# EAGLE design controller_board_LCD (EAGLE 9.0.0)
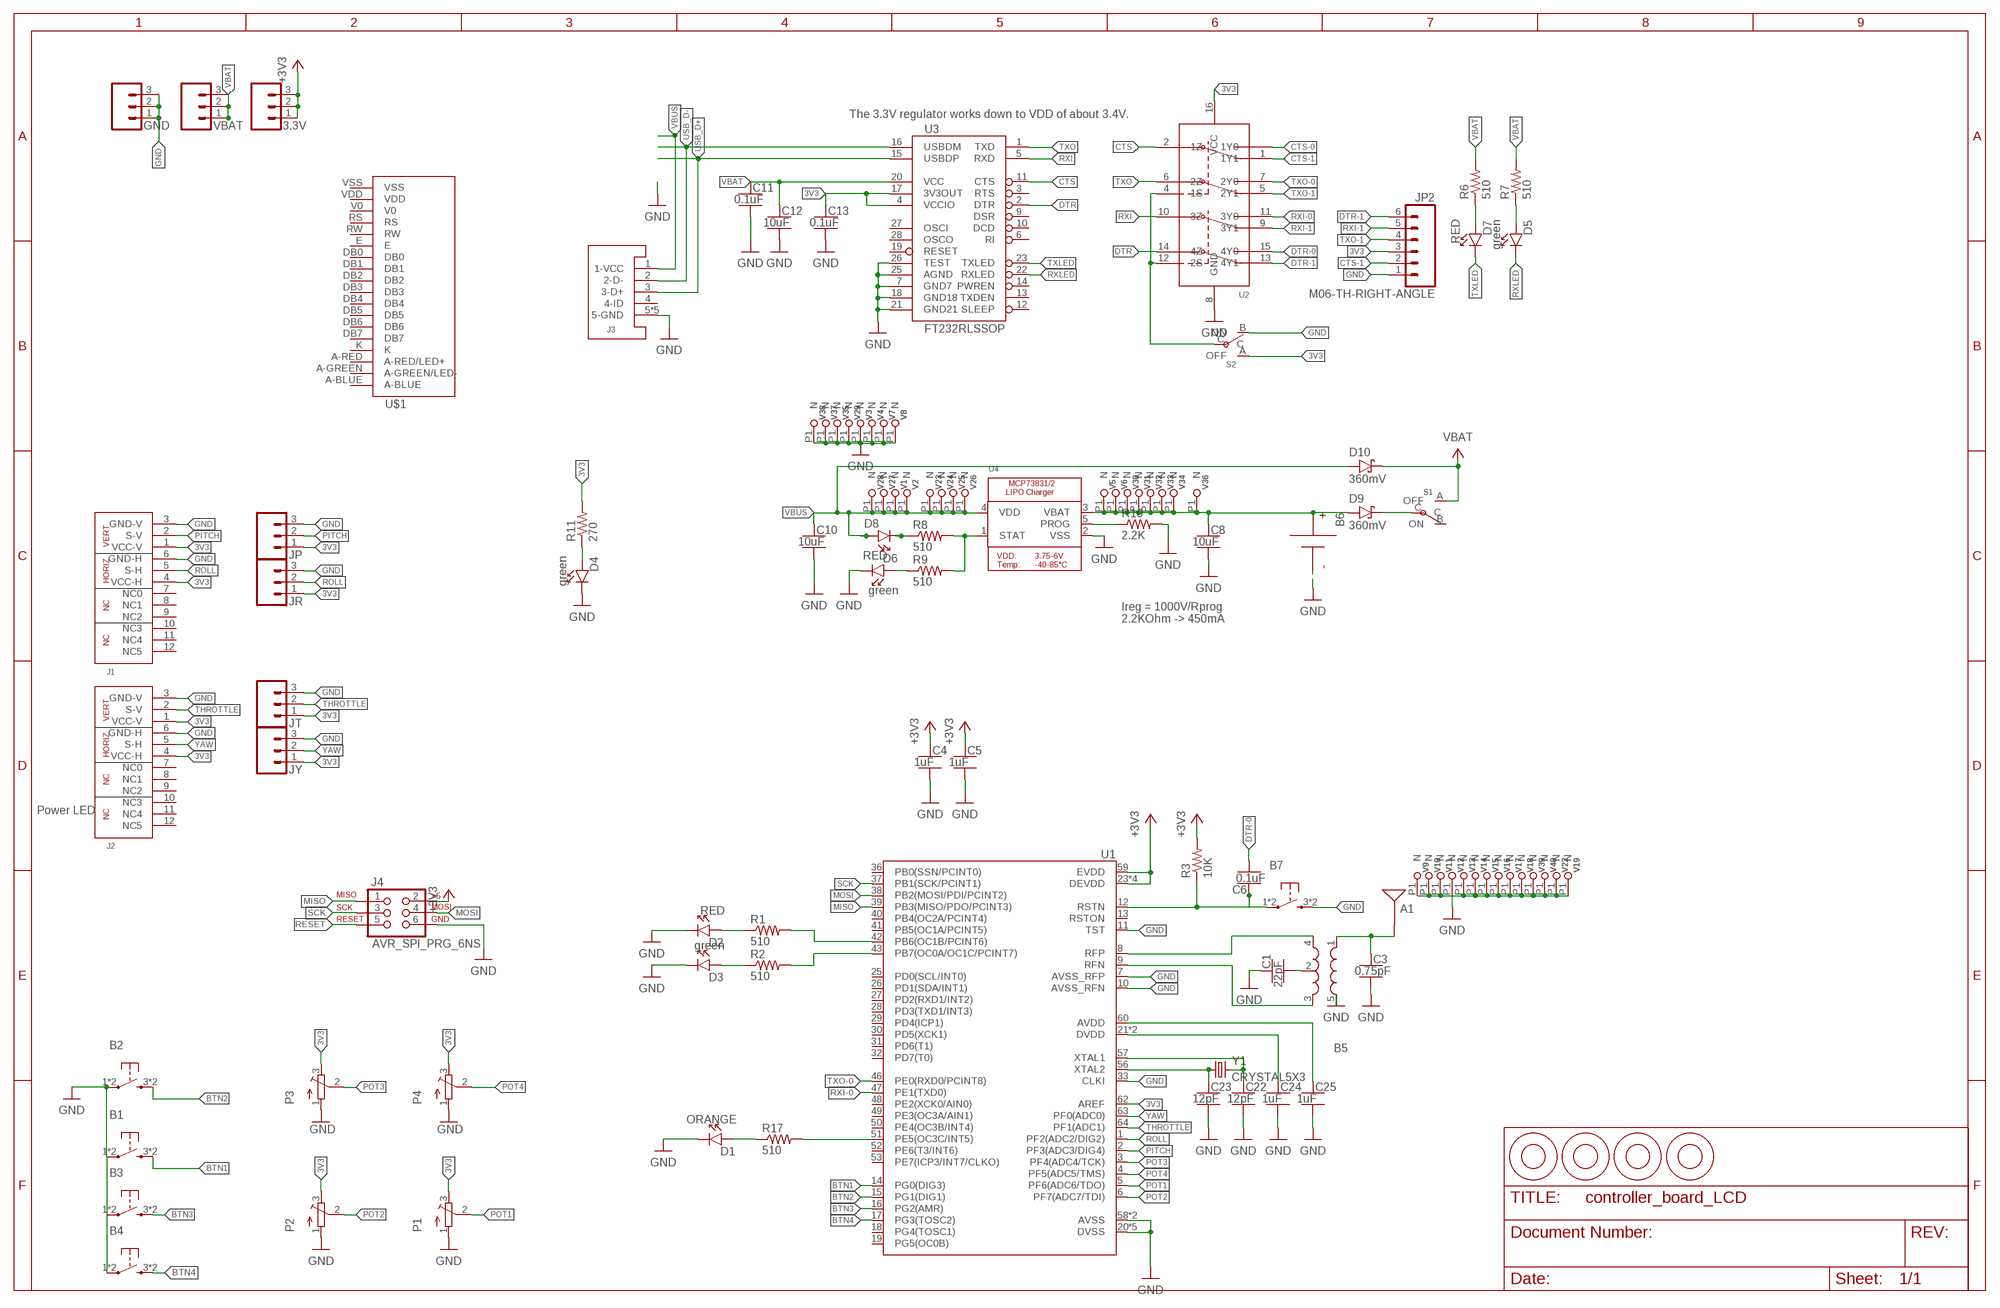
[diagram p0: schematic, sheet 1]
FRAME1 (FRAME_B_L): CREATOR: Unknown; DIST: Unknown; DISTPN: Unknown

## Parts
3.3V  HEADER-0.1IN-3POS-SCREW  [SCREW-TERMINAL-1X3-2.54MM]
A1  ANTENNA2SMD5  [ANTENNA-CHIP5]
B1  PUSHBUTTON_SMD-VERTICAL-1  [TE_FSM8JSMA_HS]
B2  PUSHBUTTON_SMD-VERTICAL-1  [TE_FSM8JSMA_HS]
B3  PUSHBUTTON_SMD-VERTICAL-1  [TE_FSM8JSMA_HS]
B4  PUSHBUTTON_SMD-VERTICAL-1  [TE_FSM8JSMA_HS]
B5  BALUN0805  [BALUN]
B6  BATTERY  [BATTERY-TERMINALS]
B7  PUSHBUTTON_SMD-VERTICAL-1  [TE_FSM8JSMA_HS]
C1  22pF  CAPACITOR-NP_SMD-2012-0805_CERAMIC-22PF  [CAPC2012X140_HS]
C3  0.75pF  CAPACITOR-NP_SMD-2012-0805_CERAMIC-0.75PF  [CAPC2012X140_HS]
C4  1uF  CAPACITOR-NP_SMD-2012-0805_CERAMIC-1UF  [CAPC2012X140_HS]
C5  1uF  CAPACITOR-NP_SMD-2012-0805_CERAMIC-1UF  [CAPC2012X140_HS]
C6  0.1uF  CAPACITOR-NP_SMD-2012-0805_CERAMIC-0.1UF  [CAPC2012X140_HS]
C8  10uF  CAPACITOR-NP_SMD-2012-0805_CERAMIC-10UF  [CAPC2012X140_HS]
C10  10uF  CAPACITOR-NP_SMD-2012-0805_CERAMIC-10UF  [CAPC2012X140_HS]
C11  0.1uF  CAPACITOR-NP_SMD-2012-0805_CERAMIC-0.1UF  [CAPC2012X140_HS]
C12  10uF  CAPACITOR-NP_SMD-2012-0805_CERAMIC-10UF  [CAPC2012X140_HS]
C13  0.1uF  CAPACITOR-NP_SMD-2012-0805_CERAMIC-0.1UF  [CAPC2012X140_HS]
C22  12pF  CAPACITOR-NP_SMD-2012-0805_CERAMIC-12PF  [CAPC2012X140_HS]
C23  12pF  CAPACITOR-NP_SMD-2012-0805_CERAMIC-12PF  [CAPC2012X140_HS]
C24  1uF  CAPACITOR-NP_SMD-2012-0805_CERAMIC-1UF  [CAPC2012X140_HS]
C25  1uF  CAPACITOR-NP_SMD-2012-0805_CERAMIC-1UF  [CAPC2012X140_HS]
D1  ORANGE  DIODE-LED_SMD-2012-0805-ORANGE  [LEDSC125X200X120-2_HS]
D2  RED  DIODE-LED_SMD-2012-0805-RED  [LEDSC125X200X120-2_HS]
D3  green  DIODE-LED_SMD-2012-0805-GREEN  [LEDSC125X200X120-2_HS]
D4  green  DIODE-LED_SMD-2012-0805-GREEN  [LEDSC125X200X120-2_HS]
D5  green  DIODE-LED_SMD-2012-0805-GREEN  [LEDSC125X200X120-2_HS]
D6  green  DIODE-LED_SMD-2012-0805-GREEN  [LEDSC125X200X120-2_HS]
D7  RED  DIODE-LED_SMD-2012-0805-RED  [LEDSC125X200X120-2_HS]
D8  RED  DIODE-LED_SMD-2012-0805-RED  [LEDSC125X200X120-2_HS]
D9  360mV  DIODE-SCHOTTKY_SMD-SOD123-360MV  [SOD3716X135_HS]
D10  360mV  DIODE-SCHOTTKY_SMD-SOD123-360MV  [SOD3716X135_HS]
F1  1mm  FIDUCIAL-STENCIL  [FIDUCIAL_STENCIL]
F2  1mm  FIDUCIAL-STENCIL  [FIDUCIAL_STENCIL]
F3  1mm  FIDUCIAL-STENCIL  [FIDUCIAL_STENCIL]
F4  1mm  FIDUCIAL-STENCIL  [FIDUCIAL_STENCIL]
GND  HEADER-0.1IN-3POS-SCREW  [SCREW-TERMINAL-1X3-2.54MM]
J1  FRSKY-GIMBAL  [JST-13-PTH]
J2  FRSKY-GIMBAL  [JST-13-PTH]
J3  USB-MICROB-EDAC-690-005-299-043  [USB-MINIB-EDAC-690-005-299-043]
J4  AVR_SPI_PRG_6NS  [2X3-NS]
JP  HEADER-0.1IN-3POS-SCREW  [SCREW-TERMINAL-1X3-2.54MM]
JP2  M06-TH-RIGHT-ANGLE  [1X06-SIP-RIGHT-ANGLE]
JR  HEADER-0.1IN-3POS-SCREW  [SCREW-TERMINAL-1X3-2.54MM]
JT  HEADER-0.1IN-3POS-SCREW  [SCREW-TERMINAL-1X3-2.54MM]
JY  HEADER-0.1IN-3POS-SCREW  [SCREW-TERMINAL-1X3-2.54MM]
P1  TRIMPOT3386  [TRIM-3386]
P2  TRIMPOT3386  [TRIM-3386]
P3  TRIMPOT3386  [TRIM-3386]
P4  TRIMPOT3386  [TRIM-3386]
R1  510  RESISTOR_SMD-2012-0805-510  [RESC2012X60_HS]
R2  510  RESISTOR_SMD-2012-0805-510  [RESC2012X60_HS]
R3  10K  RESISTOR_SMD-2012-0805-10K  [RESC2012X60_HS]
R6  510  RESISTOR_SMD-2012-0805-510  [RESC2012X60_HS]
R7  510  RESISTOR_SMD-2012-0805-510  [RESC2012X60_HS]
R8  510  RESISTOR_SMD-2012-0805-510  [RESC2012X60_HS]
R9  510  RESISTOR_SMD-2012-0805-510  [RESC2012X60_HS]
R10  2.2K  RESISTOR_SMD-2012-0805-2.2K  [RESC2012X60_HS]
R11  270  RESISTOR_SMD-2012-0805-270  [RESC2012X60_HS]
R17  510  RESISTOR_SMD-2012-0805-510  [RESC2012X60_HS]
S1  POWER-SWITCH-MFS201N-9-ZJS102011SAQN  [JS102011SAQN]
S2  POWER-SWITCH-MFS201N-9-ZJS102011SAQN  [JS102011SAQN]
U1  ATMEGA128RFA1  [QFN-64]
U2  DPDT-X2  [SOP65P640X110-16]
U3  FT232RLSSOP  [SSOP28DB]
U4  MCP73831T-2ACI/OT  MCP73831/2  [SOT23-5]
U$1  SPARKFUN_LCD_33_SERIAL-RGB  [SPARKFUN_LCD_33_PARALLEL]
V1  LOCKED-VIA-0.2  [VIA-0.2MM]
V2  LOCKED-VIA-0.2  [VIA-0.2MM]
V3  LOCKED-VIA-0.2  [VIA-0.2MM]
V4  LOCKED-VIA-0.2  [VIA-0.2MM]
V5  LOCKED-VIA-0.2  [VIA-0.2MM]
V6  LOCKED-VIA-0.2  [VIA-0.2MM]
V7  LOCKED-VIA-0.2  [VIA-0.2MM]
V8  LOCKED-VIA-0.2  [VIA-0.2MM]
V9  LOCKED-VIA-0.2  [VIA-0.2MM]
V10  LOCKED-VIA-0.2  [VIA-0.2MM]
V11  LOCKED-VIA-0.2  [VIA-0.2MM]
V12  LOCKED-VIA-0.2  [VIA-0.2MM]
V13  LOCKED-VIA-0.2  [VIA-0.2MM]
V14  LOCKED-VIA-0.2  [VIA-0.2MM]
V15  LOCKED-VIA-0.2  [VIA-0.2MM]
V16  LOCKED-VIA-0.2  [VIA-0.2MM]
V17  LOCKED-VIA-0.2  [VIA-0.2MM]
V18  LOCKED-VIA-0.2  [VIA-0.2MM]
V19  LOCKED-VIA-0.2  [VIA-0.2MM]
V22  LOCKED-VIA-0.2  [VIA-0.2MM]
V23  LOCKED-VIA-0.2  [VIA-0.2MM]
V24  LOCKED-VIA-0.2  [VIA-0.2MM]
V25  LOCKED-VIA-0.2  [VIA-0.2MM]
V26  LOCKED-VIA-0.2  [VIA-0.2MM]
V27  LOCKED-VIA-0.2  [VIA-0.2MM]
V28  LOCKED-VIA-0.2  [VIA-0.2MM]
V29  LOCKED-VIA-0.2  [VIA-0.2MM]
V30  LOCKED-VIA-0.2  [VIA-0.2MM]
V31  LOCKED-VIA-0.2  [VIA-0.2MM]
V32  LOCKED-VIA-0.2  [VIA-0.2MM]
V33  LOCKED-VIA-0.2  [VIA-0.2MM]
V34  LOCKED-VIA-0.2  [VIA-0.2MM]
V35  LOCKED-VIA-0.2  [VIA-0.2MM]
V36  LOCKED-VIA-0.2  [VIA-0.2MM]
V37  LOCKED-VIA-0.2  [VIA-0.2MM]
V38  LOCKED-VIA-0.2  [VIA-0.2MM]
V39  LOCKED-VIA-0.2  [VIA-0.2MM]
V40  LOCKED-VIA-0.2  [VIA-0.2MM]
VBAT  HEADER-0.1IN-3POS-SCREW  [SCREW-TERMINAL-1X3-2.54MM]
Y1  CRYSTAL5X3  [CRYSTAL-SMD-5X3]

## Nets
3V3 [HIGH-I]: 3.3V.1 3.3V.2 3.3V.3 C4.1 C5.1 C13.1 J1.1(VCC-V) J1.4(VCC-H) J2.1(VCC-V) J2.4(VCC-H) J4.2 JP2.3 JP.1 JR.1 JT.1 JY.1 P1.3(E) P2.3(E) P3.3(E) P4.3(E) R3.2 R11.2 S2.A(OFF) U1.23(DEVDD) U1.34(DEVDD) U1.44(DEVDD) U1.54(DEVDD) U1.59(EVDD) U1.62(AREF) U2.16(VCC) U3.4(VCCIO) U3.17(3V3OUT) ; supply symbol labelled +3V3
ANTENNA [RFSIG]: A1.FEED(SIGNAL) B5.1(IN) C3.1
BPOS [HIGH-I]: B6.+(P) C8.1 D9.A U4.3(VBAT) V5.P1(N) V6.P1(N) V30.P1(N) V31.P1(N) V32.P1(N) V33.P1(N) V34.P1(N) V36.P1(N)
BTN1: B1.3 B1.4 U1.14(PG0(DIG3))
BTN2: B2.3 B2.4 U1.15(PG1(DIG1))
BTN3: B3.3 B3.4 U1.16(PG2(AMR))
BTN4: B4.3 B4.4 U1.17(PG3(TOSC2))
CTS: U2.2(1Z) U3.11(CTS)
CTS-0: U2.3(1Y0)
CTS-1: JP2.2 U2.1(1Y1)
DTR: U2.14(4Z) U3.2(DTR)
DTR-0: C6.2 U2.15(4Y0)
DTR-1: JP2.6 U2.13(4Y1)
GND [HIGH-I]: B1.1 B1.2 B2.1 B2.2 B3.1 B3.2 B4.1 B4.2 B5.5(GND) B6.-(N) B7.3 B7.4 C1.1 C3.2 C4.2 C5.2 C8.2 C10.2 C11.2 C12.2 C13.2 C22.2 C23.2 C24.2 C25.2 D1.1(C) D2.2(C) D3.1(C) D4.1(C) D6.1(C) GND.1 GND.2 GND.3 J1.3(GND-V) J1.6(GND-H) J2.3(GND-V) J2.6(GND-H) J3.5(5-GND) J3.P6(5-GND) J3.P7(5-GND) J3.P8(5-GND) J3.P9(5-GND) J4.6 JP2.1 JP.3 JR.3 JT.3 JY.3 P1.1(A) P2.1(A) P3.1(A) P4.1(A) R10.2 S2.B(ON) U1.7(AVSS_RFP) U1.10(AVSS_RFN) U1.11(TST) U1.20(DVSS) U1.24(DVSS) U1.33(CLKI) U1.35(DVSS) U1.45(DVSS) U1.55(DVSS) U1.58(AVSS) U1.61(AVSS) U2.8(GND) U3.7(GND7) U3.18(GND18) U3.21(GND21) U3.25(AGND) U3.26(TEST) U4.2(VSS) V3.P1(N) V4.P1(N) V7.P1(N) V8.P1(N) V9.P1(N) V10.P1(N) V11.P1(N) V12.P1(N) V13.P1(N) V14.P1(N) V15.P1(N) V16.P1(N) V17.P1(N) V18.P1(N) V19.P1(N) V22.P1(N) V29.P1(N) V35.P1(N) V37.P1(N) V38.P1(N) V39.P1(N) V40.P1(N)
MISO: J4.1 U1.39(PB3(MISO/PDO/PCINT3))
MOSI: J4.4 U1.38(PB2(MOSI/PDI/PCINT2))
N$1 [HIGH-I]: D9.C S1.C
N$2: D7.1(A) R6.1
N$3: D5.2(A) R7.1
N$4: R2.2 U1.43(PB7(OC0A/OC1C/PCINT7))
N$6: D8.2(C) R8.1
N$7: B5.2(GND) C1.2
N$8: R1.2 U1.42(PB6(OC1B/PCINT6))
N$9: D2.1(A) R1.1
N$10: D3.2(A) R2.1
N$11: R8.2 R9.2 U4.1(STAT)
N$12: R10.1 U4.5(PROG)
N$13: D6.2(A) R9.1
N$14: D4.2(A) R11.1
N$15: C22.1 U1.57(XTAL1) Y1.3
N$16: R17.2 U1.51(PE5(OC3C/INT5))
N$18: D1.2(A) R17.1
N$19: C23.1 U1.56(XTAL2) Y1.1
N$20: C24.1 U1.21(DVDD) U1.22(DVDD)
N$21: C25.1 U1.60(AVDD)
PITCH: J1.2(S-V) JP.2 U1.2(PF3(ADC3/DIG4))
POT1: P1.2(S) U1.5(PF6(ADC6/TDO))
POT2: P2.2(S) U1.6(PF7(ADC7/TDI))
POT3: P3.2(S) U1.3(PF4(ADC4/TCK))
POT4: P4.2(S) U1.4(PF5(ADC5/TMS))
PROG_SEL: S2.C U2.4(1S) U2.12(2S)
RESET: B7.1 B7.2 C6.1 J4.5 R3.1 U1.12(RSTN)
RFN: B5.3(OUT2) U1.9(RFN)
RFP: B5.4(OUT1) U1.8(RFP)
ROLL: J1.5(S-H) JR.2 U1.1(PF2(ADC2/DIG2))
RXI: U2.10(3Z) U3.5(RXD)
RXI-0: U1.47(PE1(TXD0)) U2.11(3Y0)
RXI-1: JP2.5 U2.9(3Y1)
RXLED: D5.1(C) U3.22(RXLED)
SCK: J4.3 U1.37(PB1(SCK/PCINT1))
THROTTLE: J2.2(S-V) JT.2 U1.64(PF1(ADC1))
TXLED: D7.2(C) U3.23(TXLED)
TXO: U2.6(2Z) U3.1(TXD)
TXO-0: U1.46(PE0(RXD0/PCINT8)) U2.7(2Y0)
TXO-1: JP2.4 U2.5(2Y1)
USB_D+: J3.3(3-D+) U3.15(USBDP)
USB_D-: J3.2(2-D-) U3.16(USBDM)
VBAT [HIGH-I]: C11.1 C12.1 D10.C R6.2 R7.2 S1.A(OFF) U3.20(VCC) VBAT.1 VBAT.2 VBAT.3
VBUS [HIGH-I]: C10.1 D8.1(A) D10.A J3.1(1-VCC) U4.4(VDD) V1.P1(N) V2.P1(N) V23.P1(N) V24.P1(N) V25.P1(N) V26.P1(N) V27.P1(N) V28.P1(N)
YAW: J2.5(S-H) JY.2 U1.63(PF0(ADC0))
Unconnected: J1.7(NC0) J1.8(NC1) J1.9(NC2) J1.10(NC3) J1.11(NC4) J1.12(NC5) J2.7(NC0) J2.8(NC1) J2.9(NC2) J2.10(NC3) J2.11(NC4) J2.12(NC5) J3.4(4-ID) S1.B(ON) U1.13(RSTON) U1.18(PG4(TOSC1)) U1.19(PG5(OC0B)) U1.25(PD0(SCL/INT0)) U1.26(PD1(SDA/INT1)) U1.27(PD2(RXD1/INT2)) U1.28(PD3(TXD1/INT3)) U1.29(PD4(ICP1)) U1.30(PD5(XCK1)) U1.31(PD6(T1)) U1.32(PD7(T0)) U1.36(PB0(SSN/PCINT0)) U1.40(PB4(OC2A/PCINT4)) U1.41(PB5(OC1A/PCINT5)) U1.48(PE2(XCK0/AIN0)) U1.49(PE3(OC3A/AIN1)) U1.50(PE4(OC3B/INT4)) U1.52(PE6(T3/INT6)) U1.53(PE7(ICP3/INT7/CLKO)) U3.3(RTS) U3.6(RI) U3.9(DSR) U3.10(DCD) U3.12(SLEEP) U3.13(TXDEN) U3.14(PWREN) U3.19(RESET) U3.27(OSCI) U3.28(OSCO) U$1.A-BLUE U$1.A-GREEN(A-GREEN/LED-) U$1.A-RED(A-RED/LED+) U$1.DB0 U$1.DB1 U$1.DB2 U$1.DB3 U$1.DB4 U$1.DB5 U$1.DB6 U$1.DB7 U$1.E U$1.K U$1.RS U$1.RW U$1.V0 U$1.VDD U$1.VSS

## Notes on the sheet
- The 3.3V regulator works down to VDD of about 3.4V.
- Ireg = 1000V/Rprog
  2.2KOhm -> 450mA
- Power LED

## Library data of the parts
3.3V GND JP JR JT JY VBAT = Components:HEADER-0.1IN-3POS: 3 pin single inline pin header, socket, or connector; DIST: digikey; DISTPN: ED10562-ND
A1 = quadparts_prebuilt:ANTENNA2: Chip antenna Single endded antenna. Common with smaller chip antennas. CHIP4 package is the GPS Chip Antenna SKU: GPS-08418. CHIP5 package is 2.4GHz chip antenna SKU: WRL-00144.; CREATOR: Swanson; DATASHEET: http://www.linxtechnologies.com/resources/data-guides/ant-xxx-chp-x.pdf; DIST: Digikey; DISTPN: ANT-2.45-CHPCT-ND; MFR: Linx Technologies Inc.; MPN: ANT-2.45-CHP-T; PRICE: 3.16; REVIEWER: Swanson
B1-B4 B7 = quadparts_prebuilt:PUSHBUTTON_: Pushbutton with 2 pins shorting 1 to 2 and two extra mounting pins 3 & 4; CREATOR: Swanson; DIST: Digikey; DISTPN: 450-1129-ND; MFR: TE Connectivity Alcoswitch Switches; MPN: FSM4JSMA; REVIEWER: Swanson
B5 = quadparts_prebuilt:BALUN: 0805 footprint balun- Ember 351/357; CREATOR: Swanson; DATASHEET: http://katalog.we-online.de/pbs/datasheet/748421245.pdf; DIST: Digikey; DISTPN: 732-2230-6-ND; MFR: Wurth Electronics Inc; MPN: 748421245; PRICE: 2.63; REVIEWER: Swanson
B6 = quadparts_prebuilt:BATTERY; CREATOR: Swanson; DIST: NA; DISTPN: NA
C1 = quadparts_prebuilt:CAPACITOR-NP_: Nonpolarized capacitor; CREATOR: Swanson; DIST: Digikey; DISTPN: 490-5534-1-ND; MFR: Murata Electronics North America; MPN: GRM21A5C2E220JW01D; REVIEWER: Swanson
C3 = quadparts_prebuilt:CAPACITOR-NP_: Nonpolarized capacitor; CREATOR: Swanson; DIST: Digikey; DISTPN: 490-3585-1-ND; MFR: Murata Electronics North America; MPN: GQM2195C2AR75CB01D; REVIEWER: Swanson
C4 C5 C24 C25 = quadparts_prebuilt:CAPACITOR-NP_: Nonpolarized capacitor; CREATOR: Swanson; DIST: Digikey; DISTPN: 587-1281-1-ND; MFR: Taiyo Yuden; MPN: TMK212B7105KG-T; REVIEWER: Swanson
C6 C11 C13 = quadparts_prebuilt:CAPACITOR-NP_: Nonpolarized capacitor; CREATOR: Swanson; DIST: Digikey; DISTPN: 445-1418-1-ND; MFR: TDK; MPN: C2012X7R2A104K125AA; REVIEWER: Swanson
C8 C10 C12 = quadparts_prebuilt:CAPACITOR-NP_: Nonpolarized capacitor; CREATOR: Swanson; DIST: Digikey; DISTPN: 445-14387-1-ND; MFR: TDK Corporation; MPN: C2012X5R1E106K085AC; REVIEWER: Swanson
C22 C23 = quadparts_prebuilt:CAPACITOR-NP_: Nonpolarized capacitor; CREATOR: Swanson; DIST: Digikey; DISTPN: 490-5531-1-ND; MFR: Murata Electronics North America; MPN: GRM21A5C2E120JW01D; REVIEWER: Swanson
D1 = RemoteParts:DIODE-LED_: Light emitting diode; CREATOR: Swanson; DIST: DIGIKEY; DISTPN: 160-1177-1-ND
D2 D7 D8 = RemoteParts:DIODE-LED_: Light emitting diode; CREATOR: Swanson; DIST: DIGIKEY; DISTPN: 160-1176-1-ND
D3-D6 = RemoteParts:DIODE-LED_: Light emitting diode; CREATOR: Swanson; DIST: Digikey; DISTPN: 160-1179-1-ND; MFR: Lite-On Inc; MPN: LTST-C170GKT; REVIEWER: Swanson
D9 D10 = quadparts_prebuilt:DIODE-SCHOTTKY_: Schottky diode; CREATOR: Swanson; DIST: Digikey; DISTPN: CRS08QMCT-ND; MFR: Toshiba Semiconductor and Storage; MPN: CRS08(TE85L,Q,M); REVIEWER: Swanson
F1-F4 = RemoteParts:FIDUCIAL; CREATOR: Swanson; DIST: NA; DISTPN: NA
J1 = RemoteParts:FRSKY-GIMBAL; CH1: PITCH; CH2: ROLL; DIST: Digikey; DISTPN: A100106-ND
J2 = RemoteParts:FRSKY-GIMBAL; CH1: THR; CH2: YAW; DIST: Digikey; DISTPN: A100106-ND
J3 = RemoteParts:USB; CREATOR: Swanson; DIST: DIGIKEY; DISTPN: 151-1206-1-ND
J4 = quadparts_prebuilt:AVR_SPI_PRG_6: AVR ISP 6 Pin This is the reduced ISP connector for AVR programming. Common on Arduino. This footprint will take up less PCB space and can be used with a 10-pin to 6-pin adapter such as SKU: BOB-08508; CREATOR: Swanson; DATASHEET: http://portal.fciconnect.com/Comergent//fci/drawing/67996.pdf; DIST: Digikey; DISTPN: 609-3234-ND; MFR: Amphenol FCI; MPN: 67997-206HLF; PRICE: 0.31; REVIEWER: Swanson
JP2 = RemoteParts:M06: Header 6 Standard 6-pin 0.1" header. Use with straight break away headers (SKU : PRT-00116), right angle break away headers (PRT-00553), swiss pins (PRT-00743), machine pins (PRT-00117), and female headers (PRT-00115). Molex polarized connector foot print use with SKU : PRT-08094 with associated crimp pins and housings. NOTES ON THE VARIANTS LOCK and LOCK_LONGPADS... This footprint was designed to help hold the alignment of a through-hole component (i.e. 6-pin header) while soldering it into place. You may notice that each hole has been shifted either up or down by 0.005 of an inch from it's more standard position (which is a perfectly straight line). This slight alteration caused the pins (the squares in the middle) to touch the edges of the holes. Because they are alternating, it causes a "brace" to hold the component in place. 0.005 has proven to be the perfect amount of "off-center" position when using our standard breakaway headers. Although looks a little odd when you look at the bare footprint, once you have a header in there, the alteration is very hard to notice. Also, if you push a header all the way into place, it is covered up entirely on the bottom side. This idea of altering the position of holes to aid alignment will be further integrated into the Sparkfun Library for other footprints. It can help hold any component with 3 or more connection pins.
P1-P4 = RemoteParts:TRIMPOT: SMT trimmer potentiometer part number TC33X http://www.ladyada.net/library/eagle; CREATOR: Swanson; DIST: Adafruit; DISTPN: 356
R1 R2 R6-R9 R17 = quadparts_prebuilt:RESISTOR_: Resistor; DIST: DIGIKEY; DISTPN: 311-510ARCT-ND
R3 = quadparts_prebuilt:RESISTOR_: Resistor; CREATOR: Swanson; DIST: Digikey; DISTPN: 311-10KARCT-ND; MFR: Yageo; MPN: RC0805JR-0710KL; REVIEWER: Swanson
R10 = quadparts_prebuilt:RESISTOR_: Resistor; DIST: DIGIKEY; DISTPN: YAG3776CT-ND
R11 = quadparts_prebuilt:RESISTOR_: Resistor; DIST: DIGIKEY; DISTPN: 311-270ARCT-ND
S1 S2 = RemoteParts:POWER-SWITCH-MFS201N-9-Z; CREATOR: Swanson; DIST: DIGIKEY; DISTPN: 401-1999-1-ND
U1 = quadparts_prebuilt:ATMEGA128RFA1: ATmega128RFA1 8-bit AVR Microcontroller with Low Power 2.4GHz Transceiver for ZigBee and IEEE 802.15.4; CREATOR: Swanson; DATASHEET: http://www.atmel.com/Images/Atmel-8266-MCU_Wireless-ATmega128RFA1_Datasheet.pdf; DIST: Digikey; DISTPN: ATMEGA128RFA1-ZU-ND; MFR: Atmel; MPN: ATMEGA128RFA1-ZUR00; PRICE: 10.21; REVIEWER: Swanson
U2 = RemoteParts:DPDT-X2; CREATOR: Swanson; DIST: DIGIKEY; DISTPN: 568-5300-1-ND
U3 = RemoteParts:FT232RL: USB UART FT232RL 4th Generation USB UART (USB <-> Serial) Controller. Spark Fun Electronics SKU : COM-00650; CREATOR: Swanson; DIST: DIGIKEY; DISTPN: 768-1007-1-ND
U4 = RemoteParts:MCP73831/2: MCP73831/2 LIPO Charger VDD: 3.75 - 6V Temp -40 - 85°C Programmable Charge Rate: 15-500mA NOTE: STAT is a tri-state logic output on the MCP73831 and an open-drain output on the MCP73832. SOT23-5 with 4.2V output and tri-state logic on STAT = MCP73831T-2ACI/OT; CREATOR: Adafruit; DIST: DIGIKEY; DISTPN: MCP73831T-2ACI/OTCT-ND
U$1 = RemoteParts:SPARKFUN_LCD_33_SERIAL; CREATOR: Swanson; DIST: SparkFun; DISTPN: LCD-10862
V1-V19 V22-V40 = quadparts_prebuilt:LOCKED-VIA; CREATOR: Swanson; DIST: NA; DISTPN: NA
Y1 = quadparts_prebuilt:CRYSTAL: Various standard crystals. Proven footprints.; CREATOR: Swanson; DATASHEET: http://www.abracon.com/Resonators/abm3b.pdf; DIST: Digikey; DISTPN: 535-9122-1-ND; MFR: Abracon LLC; MPN: ABM3B-16.000MHZ-B2-T; PRICE: 0.68; PROD_ID: XTAL-08218; REVIEWER: Swanson

## Net classes
1 HIGH-I: width 0.381 mm
2 RFSIG: width 0.762 mm

## Board
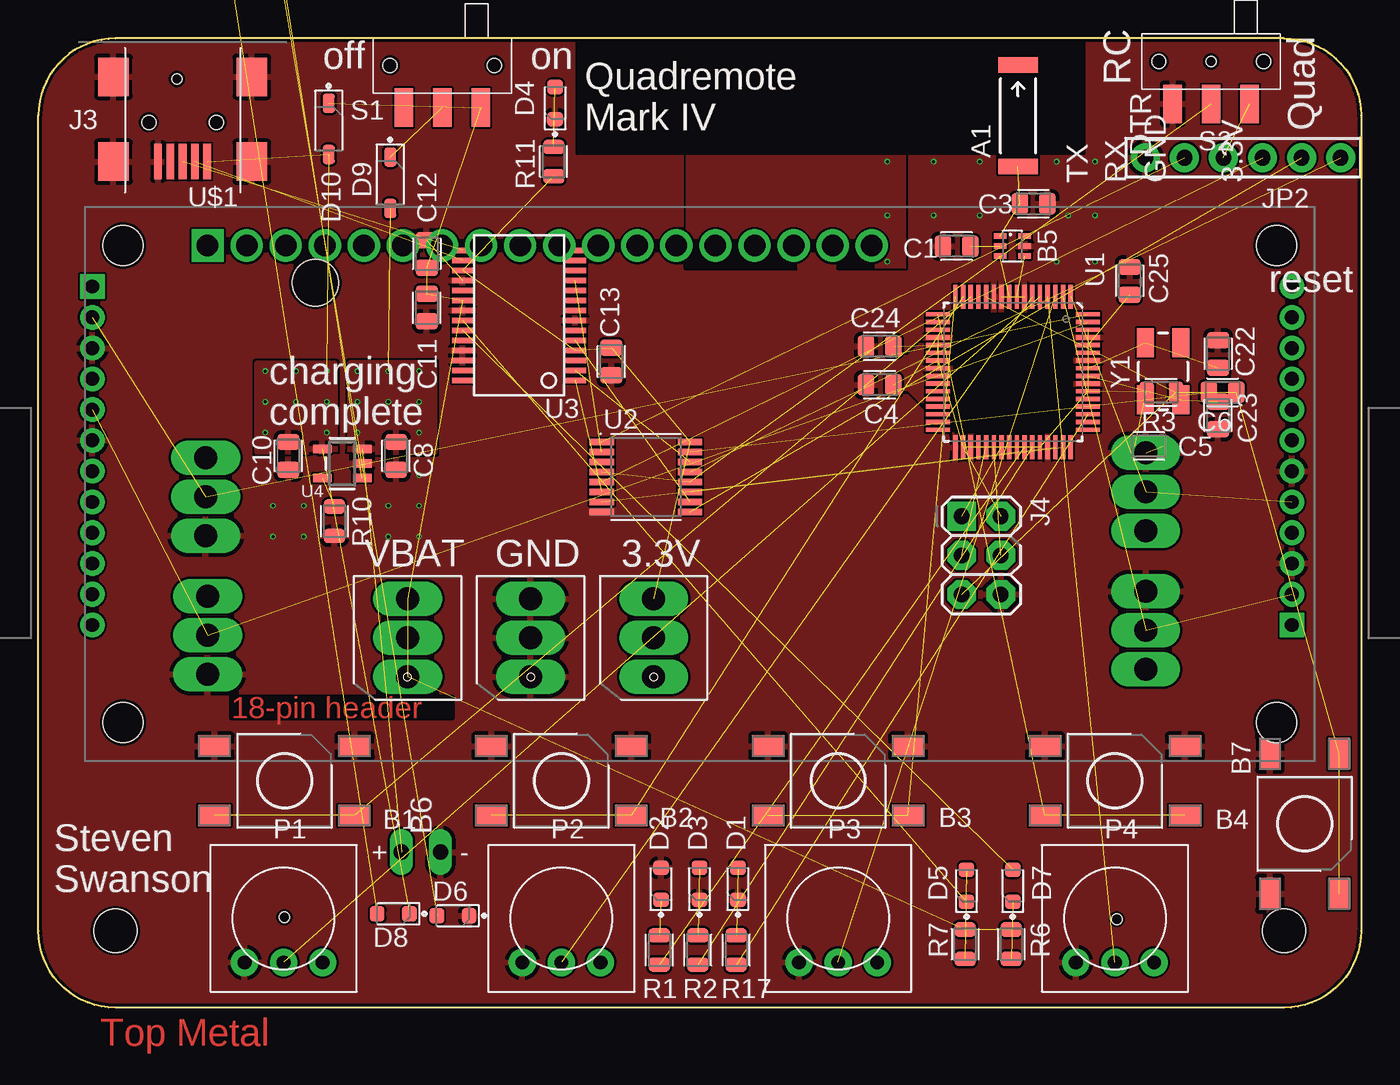
[diagram p1: board, top side]
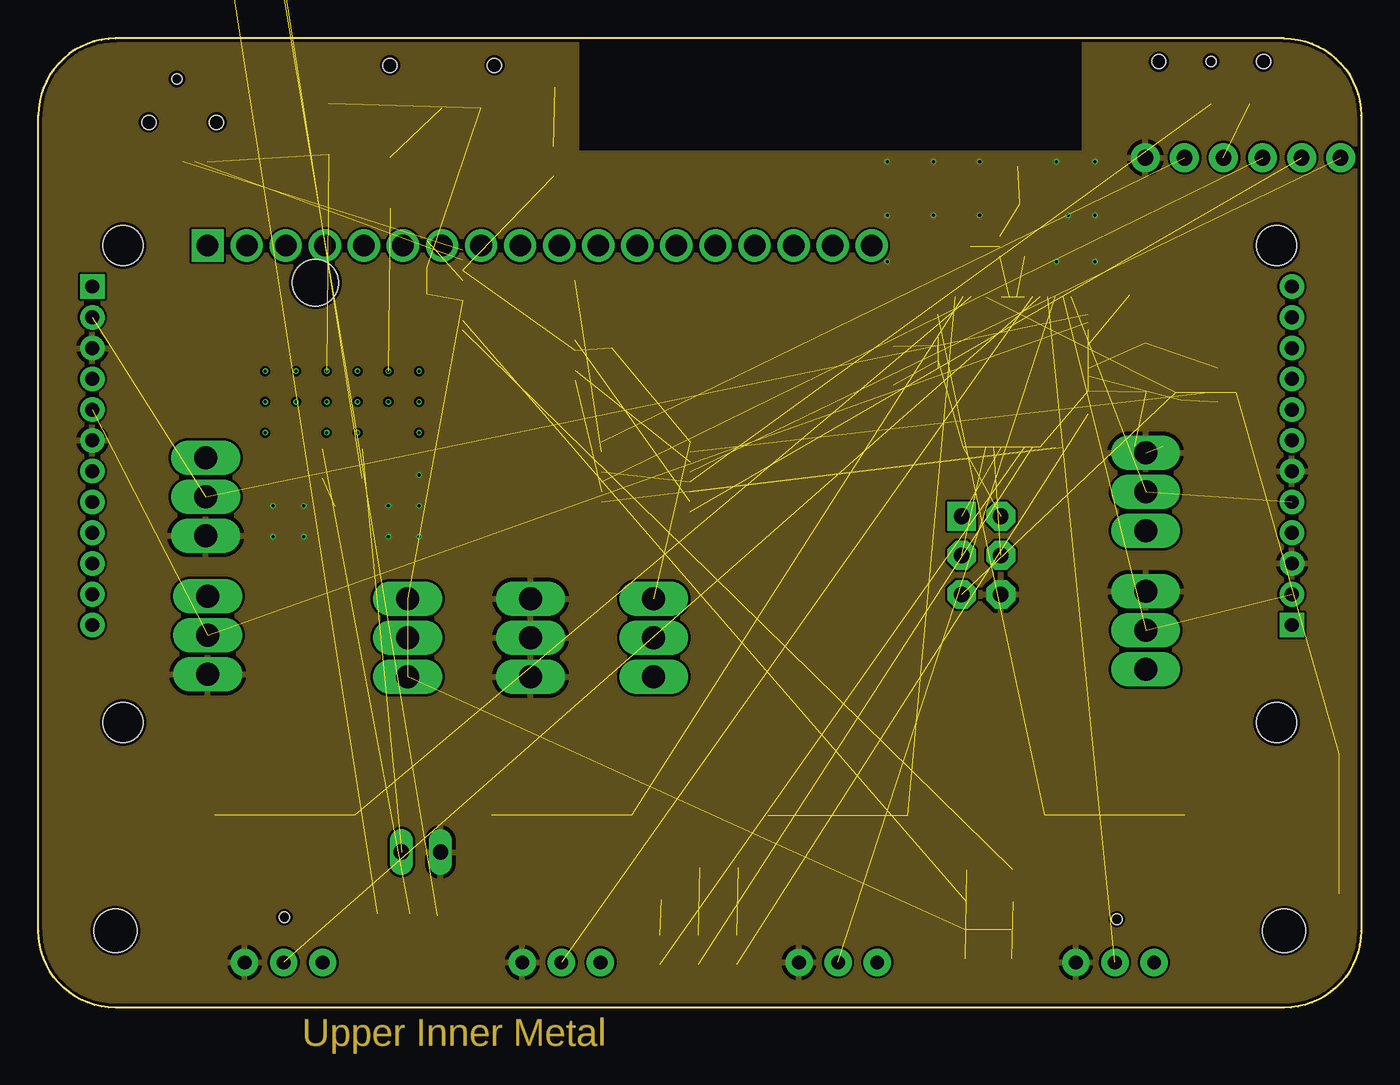
[diagram p2: board, inner layer Route2]
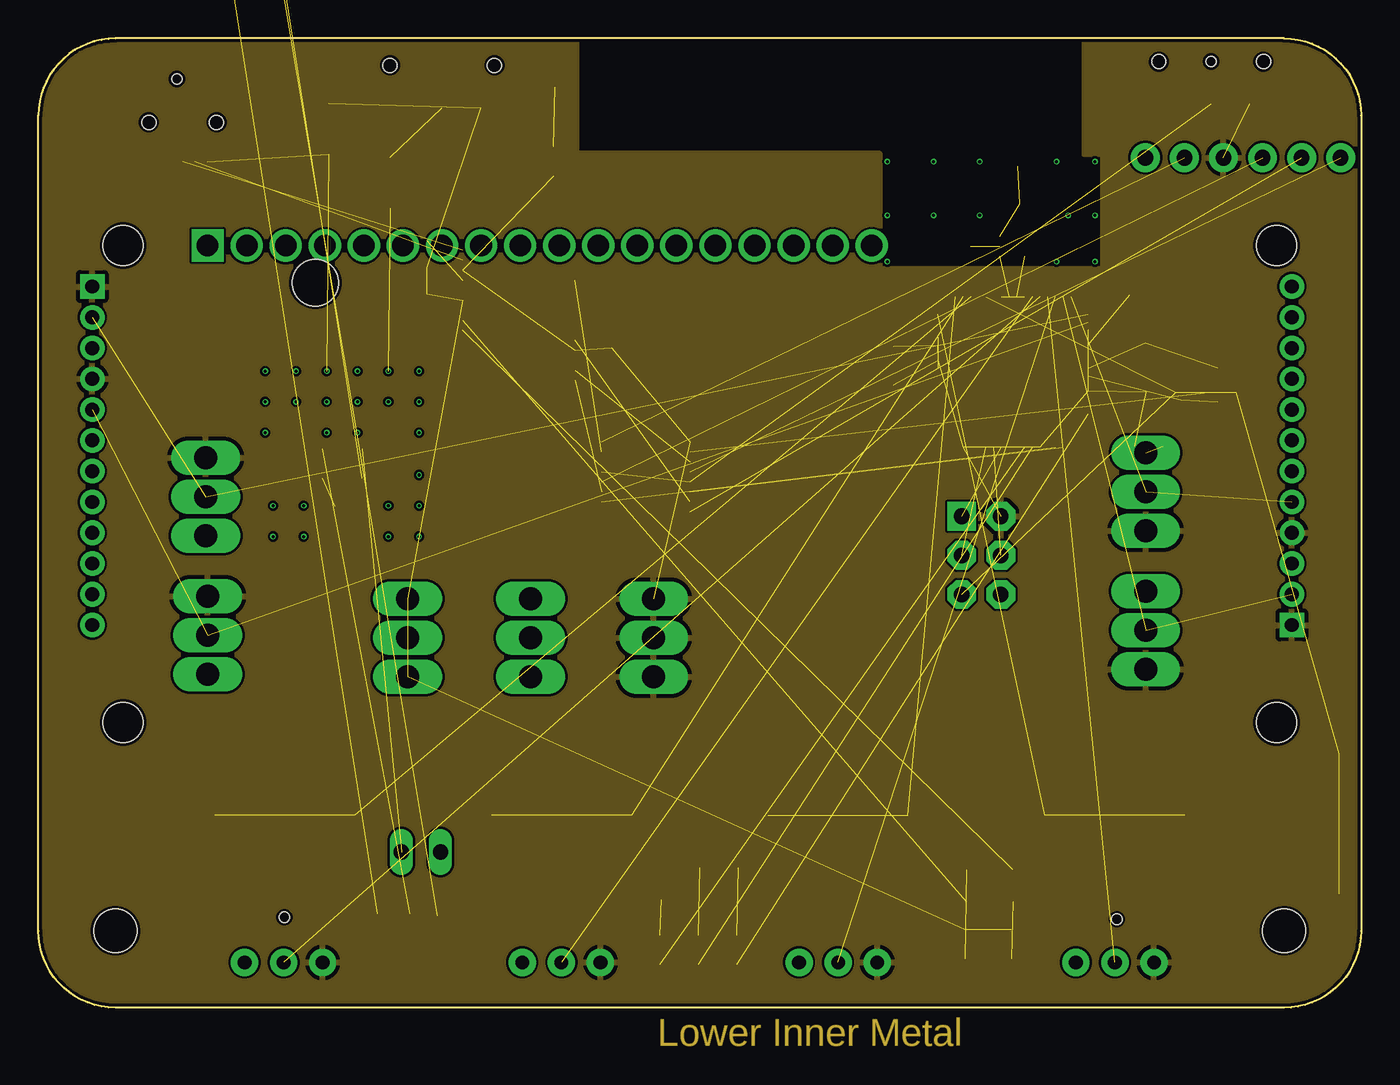
[diagram p3: board, inner layer Route15]
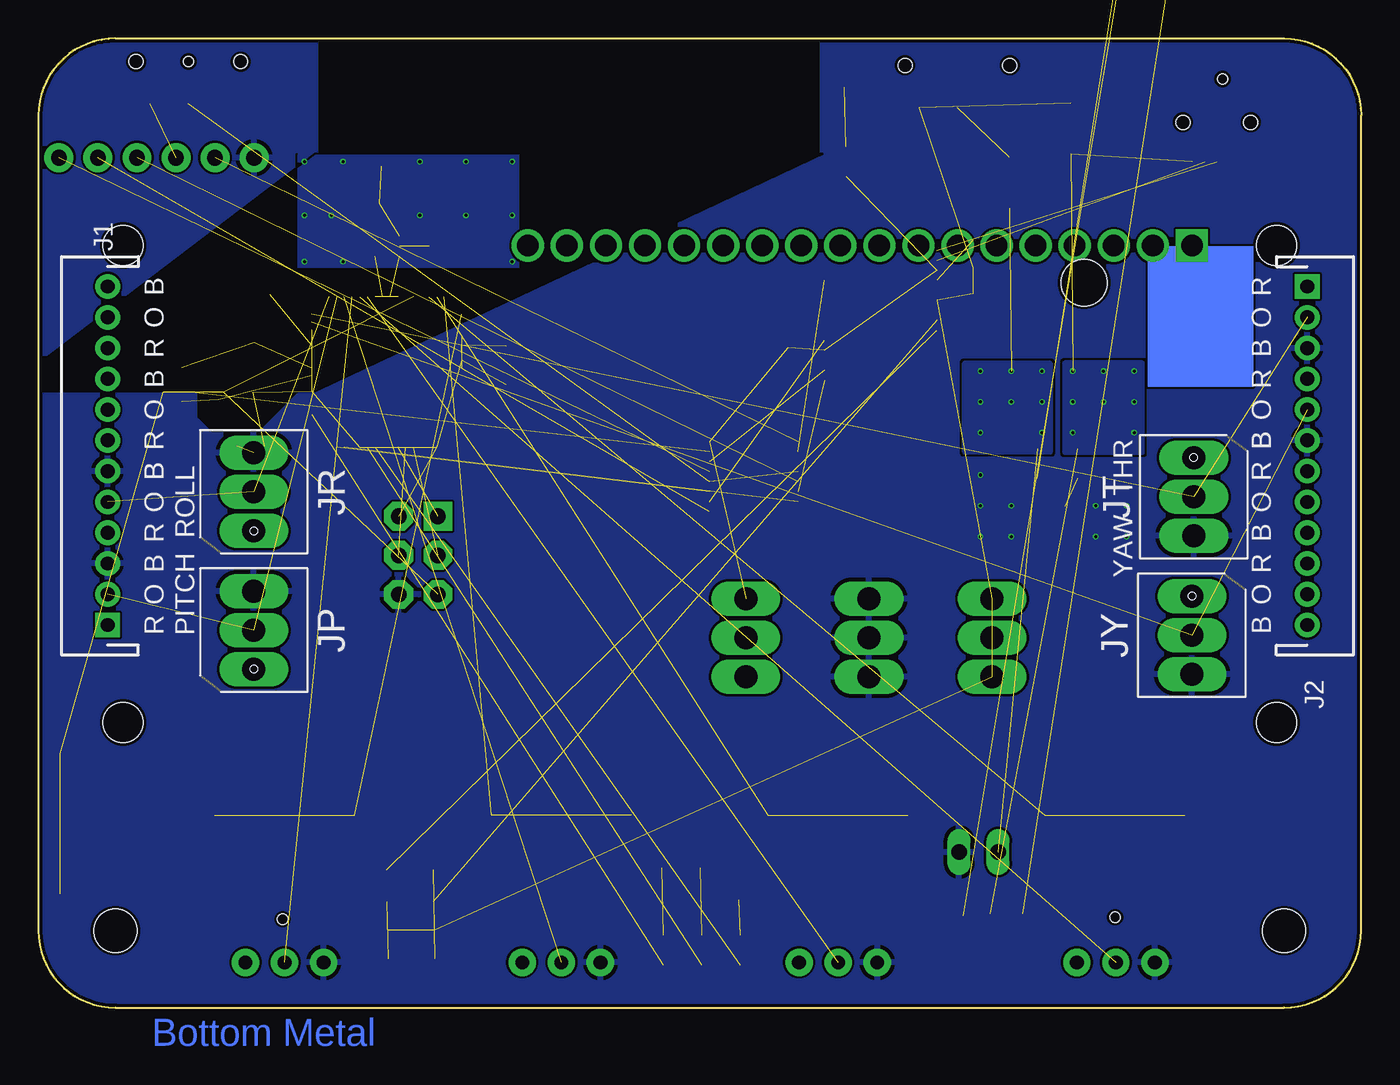
[diagram p4: board, bottom side, seen from below]

Size 86 x 63 mm. Coordinates in mm from the lower left corner, seen from the top.
Outline: 86,58 86,5 arc-90 81,0 5,0 arc-90 0,5 0,58 arc-90 5,63 81,63 arc-90 86,58
Copper layers (1*2*15*16): Top 0.035559375mm / dielectric 1.501140625mm / Route2 0.035559375mm / dielectric 0.149859375mm / Route15 0.035559375mm / dielectric 0.200659375mm / Bottom 0.035559375mm
Design rules "jlcpcb-4layer-6mil *": minimum track width 6mil, minimum drill 0.2mm, track to track 6mil, track to pad 6mil, pad to pad 6mil, via to via 6mil, smd to smd 5mil, copper to edge 0.2mm, drill to drill 10mil, minimum pad ring 3mil, minimum via ring 5mil, stop-mask expansion 3mil, vias tented up to drill 0.2mm, thermal gap 10mil
Holes 2.8 mm at 81,5 5,5
Holes 3 mm at 18,47.12
tRestrict: 14 lines
bRestrict: 14 lines

### Footprints (pad centres in the part's own frame; a part is rotated, then mirrored left to right if it is on the bottom)
SCREW-TERMINAL-1X3-2.54MM = drill 1.5 pad 1.778 long: 1 0,0; 2 2.54,0; 3 5.08,0
ANTENNA-CHIP5 = smd 1.016 x 2.54: FEED -3.302,0; NC 3.302,0
TE_FSM8JSMA_HS = smd 1.4 x 2.1: 1 -2.25,4.55; 2 -2.25,-4.55; 3 2.25,4.55; 4 2.25,-4.55
BALUN = smd 0.35 x 0.8: 1 -0.65,-0.8; 2 0,-0.8; 3 0.65,-0.8; 4 0.65,0.8; 5 0,0.8; 6 -0.65,0.8
BATTERY-TERMINALS = drill 1 long: + -1.27,-0.635; - 1.27,-0.635
CAPC2012X140_HS = smd 1.08 x 1.42: 1 -0.895,0; 2 0.895,0
LEDSC125X200X120-2_HS = smd 0.94 x 0.99: 1 1.745,-0.9; 2 -0.345,-0.9
SOD3716X135_HS = smd 1.25 x 0.8: A 1.665,0; C -1.665,0
FRSKY-TARANIS-GIMBAL = hole 2.8: -27,27; -27,-27; 27,-27; 27,27
FIDUCIAL_STENCIL = hole 0.66: 0,0
JST-13-PTH = drill 0.9 pad 1.6 square: 1 -2,0 | drill 0.9 pad 1.6: 2 0,0; 3 2,0; 4 4,0; 5 6,0; 6 8,0; 7 10,0; 8 12,0; 9 14,0; 10 16,0; 11 18,0; 12 20,0
USB-MINIB-EDAC-690-005-299-043 = smd 2.3 x 0.5: 1 5.5,1.6; 2 5.5,0.8; 3 5.5,0; 4 5.5,-0.8; 5 5.5,-1.6 | smd 2.5 x 2: P6 5.5,-4.5; P7 5.5,4.5; P8 0,4.5; P9 0,-4.5 | hole 0.9: 2.95,2.2; 2.95,-2.2
2X3-NS = drill 1.016 pad 1.88 square: 1 -2.54,-1.27 | drill 1.016 pad 1.88 octagon: 2 -2.54,1.27; 3 0,-1.27; 4 0,1.27; 5 2.54,-1.27; 6 2.54,1.27
1X06-SIP-RIGHT-ANGLE = drill 1.016 pad 1.88: 1 -6.35,0; 2 -3.81,0; 3 -1.27,0; 4 1.27,0; 5 3.81,0; 6 6.35,0
TRIM-3386 = drill 0.9 pad 1.778: 1 -2.54,-2.857; 2 0,-2.857; 3 2.54,-2.857
RESC2012X60_HS = smd 0.92 x 1.38: 1 -0.955,0; 2 0.955,0
JS102011SAQN = smd 1.2 x 2.5: A -2.5,2.75; B 2.5,2.75; C 0,2.75 | hole 0.9: 3.4,0; -3.4,0
QFN-64 = smd 1.562 x 0.28: 1 -4.881,3.75; 2 -4.881,3.25; 3 -4.881,2.75; 4 -4.881,2.25; 5 -4.881,1.75; 6 -4.881,1.25; 7 -4.881,0.75; 8 -4.881,0.25; 9 -4.881,-0.25; 10 -4.881,-0.75; 11 -4.881,-1.25; 12 -4.881,-1.75; 13 -4.881,-2.25; 14 -4.881,-2.75; 15 -4.881,-3.25; 16 -4.881,-3.75; 33 4.881,-3.75; 34 4.881,-3.25; 35 4.881,-2.75; 36 4.881,-2.25; 37 4.881,-1.75; 38 4.881,-1.25; 39 4.881,-0.75; 40 4.881,-0.25; 41 4.881,0.25; 42 4.881,0.75; 43 4.881,1.25; 44 4.881,1.75; 45 4.881,2.25; 46 4.881,2.75; 47 4.881,3.25; 48 4.881,3.75 | smd 0.28 x 1.562: 17 -3.75,-4.881; 18 -3.25,-4.881; 19 -2.75,-4.881; 20 -2.25,-4.881; 21 -1.75,-4.881; 22 -1.25,-4.881; 23 -0.75,-4.881; 24 -0.25,-4.881; 25 0.25,-4.881; 26 0.75,-4.881; 27 1.25,-4.881; 28 1.75,-4.881; 29 2.25,-4.881; 30 2.75,-4.881; 31 3.25,-4.881; 32 3.75,-4.881; 49 3.75,4.881; 50 3.25,4.881; 51 2.75,4.881; 52 2.25,4.881; 53 1.75,4.881; 54 1.25,4.881; 55 0.75,4.881; 56 0.25,4.881; 57 -0.25,4.881; 58 -0.75,4.881; 59 -1.25,4.881; 60 -1.75,4.881; 61 -2.25,4.881; 62 -2.75,4.881; 63 -3.25,4.881; 64 -3.75,4.881
SOP65P640X110-16 = smd 1.572 x 0.407: 1 -2.872,2.275; 2 -2.872,1.625; 3 -2.872,0.975; 4 -2.872,0.325; 5 -2.872,-0.325; 6 -2.872,-0.975; 7 -2.872,-1.625; 8 -2.872,-2.275; 9 2.872,-2.275; 10 2.872,-1.625; 11 2.872,-0.975; 12 2.872,-0.325; 13 2.872,0.325; 14 2.872,0.975; 15 2.872,1.625; 16 2.872,2.275
SSOP28DB = smd 0.348 x 1.397: 1 -4.225,-3.656; 2 -3.575,-3.656; 3 -2.925,-3.656; 4 -2.275,-3.656; 5 -1.625,-3.656; 6 -0.975,-3.656; 7 -0.325,-3.656; 8 0.325,-3.656; 9 0.975,-3.656; 10 1.625,-3.656; 11 2.275,-3.656; 12 2.925,-3.656; 13 3.575,-3.656; 14 4.225,-3.656; 15 4.225,3.656; 16 3.575,3.656; 17 2.925,3.656; 18 2.275,3.656; 19 1.625,3.656; 20 0.975,3.656; 21 0.325,3.656; 22 -0.325,3.656; 23 -0.975,3.656; 24 -1.625,3.656; 25 -2.275,3.656; 26 -2.925,3.656; 27 -3.575,3.656; 28 -4.225,3.656
SOT23-5 = smd 0.55 x 1.2: 1 -0.95,-1.3; 2 0,-1.3; 3 0.95,-1.3; 4 0.95,1.3; 5 -0.95,1.3
SPARKFUN_LCD_33_PARALLEL = drill 1.4: A-BLUE 8.64,15.5; A-GREEN 11.18,15.5; A-RED 6.1,15.5; DB0 -16.76,15.5; DB1 -14.22,15.5; DB2 -11.68,15.5; DB3 -9.14,15.5; DB4 -6.6,15.5; DB5 -4.06,15.5; DB6 -1.52,15.5; DB7 1.02,15.5; E -19.3,15.5; K 3.56,15.5; RS -24.38,15.5; RW -21.84,15.5; V0 -26.92,15.5; VDD -29.46,15.5 | drill 1.4 square: VSS -32,15.5 | hole 2.6: -37.5,15.5; -37.5,-15.5; 37.5,-15.5; 37.5,15.5
VIA-0.2MM = drill 0.2 pad 0.3: P1 0,0
CRYSTAL-SMD-5X3 = smd 1.9 x 1.1: 1 -1.85,-1.15; 2 1.85,-1.15; 3 1.85,1.15; 4 -1.85,1.15

### Placement (x,y rotation side)
3.3V  40,21.5 90 top
A1  63.7,57.98 90 top
B1  16,14.75 270 top
B2  34,14.75 270 top
B3  52,14.75 270 top
B4  70,14.75 270 top
B5  63.33,49.5 270 top
B6  24.88,10.75 0 top
B7  82.33,11.95 180 top
C1  59.7,49.5 0 top
C3  64.7,52.25 0 top
C4  54.7,40.5 180 top
C5  72.2,36.5 0 top
C6  77,40 180 top
C8  23.25,35.88 270 top
C10  16.25,35.88 270 top
C11  25.25,45.5 270 top
C12  25.25,49 90 top
C13  37.25,42 270 top
C22  76.7,42.5 90 top
C23  76.7,38.5 270 top
C24  54.7,43 180 top
C25  70.95,47.25 90 top
D1  46.38,8.75 270 top
D2  41.38,8.75 270 top
D3  43.88,8.75 270 top
D4  34.5,59.5 270 top
D5  61.25,8.62 270 top
D6  26.25,6.88 0 top
D7  64.25,8.62 270 top
D8  22.38,7 0 top
D9  22.88,53.62 270 top
D10  18.88,57.12 270 top
E$1  [FRSKY-TARANIS-GIMBAL]  -35.5,31.5 0 top  (outside the outline)
E$2  [FRSKY-TARANIS-GIMBAL]  121.5,31.5 180 top  (outside the outline)
F1  9,60.38 0 top
F2  70.12,5.75 0 top
F3  76.25,61.5 0 top
F4  16,5.88 0 top
GND  32,21.5 90 top
J1  81.5,26.88 90 bottom
J2  3.5,44.88 270 bottom
J3  9.38,60.5 270 top
J4  61.3,29.4 270 top
JP  72,22 90 bottom
JP2  78.33,55.25 0 top
JR  72,31 90 bottom
JT  10.88,35.75 270 bottom
JY  11,26.75 270 bottom
P1  15.94,5.8 0 top
P2  34,5.8 0 top
P3  52,5.8 0 top
P4  70,5.8 0 top
R1  40.38,3.75 270 top
R2  42.88,3.75 270 top
R3  73,40 180 top
R6  63.25,4.12 90 top
R7  60.25,4.12 90 top
R8  9.25,86.88 270 top  (outside the outline)
R9  13.75,79.75 90 top  (outside the outline)
R10  19.25,31.62 270 top
R11  33.5,55 270 top
R17  45.38,3.75 270 top
S1  26.25,61.25 180 top
S2  76.25,61.5 180 top
U1  63.37,41.32 270 top
U2  39.5,34.5 0 top
U3  31.25,45 90 top
U4  19.75,35.38 90 top
U$1  43,34.04 0 top
V1  14.75,37.38 180 top
V2  14.75,41.38 180 top
V3  24.75,34.62 180 top
V4  24.75,30.62 180 top
V5  24.75,37.38 180 top
V6  24.75,41.38 180 top
V7  15.25,30.62 180 top
V8  15.25,32.62 180 top
V9  55.2,55 0 top
V10  55.2,48.5 0 top
V11  68.7,55 0 top
V12  68.7,48.5 0 top
V13  66.2,55 0 top
V14  66.2,48.5 0 top
V15  61.2,55 0 top
V16  58.2,55 0 top
V17  66.95,51.5 0 top
V18  55.2,51.5 0 top
V19  22.75,30.62 0 top
V22  68.7,51.5 0 top
V23  18.75,37.38 180 top
V24  18.75,41.38 180 top
V25  18.75,39.38 180 top
V26  16.75,39.38 180 top
V27  14.75,39.38 180 top
V28  16.75,41.38 180 top
V29  24.75,32.62 180 top
V30  24.75,39.38 180 top
V31  22.75,39.38 180 top
V32  20.75,39.38 180 top
V33  20.75,41.38 180 top
V34  22.75,41.38 180 top
V35  22.75,32.62 180 top
V36  20.75,37.38 180 top
V37  17.25,32.62 180 top
V38  17.25,30.62 180 top
V39  58.2,51.5 0 top
V40  61.2,51.5 0 top
VBAT  24,21.5 90 top
Y1  73.12,41.37 90 top

### Tracks (layer width: path | path; a pad name or v marks a point on that pad's centre or on a via)
3V3  (15 unrouted)
  pour Route15: 35,69.5 -3.5,69.5 -3.5,-2 89.5,-2 89.5,69.5 68,69.5 68,55.5 69.2,55.5 69.2,48 54.7,48 54.7,55.5 35,55.5
ANTENNA  (2 unrouted)
BPOS  (2 unrouted)
  pour Top: 20.25,36.12 25.75,36.12 25.75,41.88 20.25,41.88
  pour Bottom: 20.25,36.12 25.75,36.12 25.75,41.88 20.25,41.88
BTN1  (2 unrouted)
BTN2  (2 unrouted)
BTN3  (2 unrouted)
BTN4  (2 unrouted)
CTS  (1 unrouted)
CTS-1  (1 unrouted)
DTR  (1 unrouted)
DTR-0  (1 unrouted)
DTR-1  (1 unrouted)
GND  (4 unrouted)
  pour Bottom: 25.75,35.5 14.25,35.5 14.25,29.88 25.75,29.88
  pour Route2: 35,69 -3,69 -3,-1.5 89,-1.5 89,69 68,69 68,55.5 35,55.5
  pour Bottom (rank 2): 35,70 -4,70 -4,-2.5 90,-2.5 90,70 68,70 68,55.5 35,55.5
  pour Top (rank 2): 35,68.5 -2.5,68.5 -2.5,-1 88.5,-1 88.5,68.5 68,68.5 68,55.5 35,55.5
  cutout Top: 59.7,45 67.08,45 67.08,37.5 59.7,37.5
MISO  (1 unrouted)
MOSI  (1 unrouted)
N$1  (1 unrouted)
N$2  (1 unrouted)
N$3  (1 unrouted)
N$4  (1 unrouted)
N$6  (1 unrouted)
N$7  (1 unrouted)
N$8  (1 unrouted)
N$9  (1 unrouted)
N$10  (1 unrouted)
N$11  (2 unrouted)
N$12  (1 unrouted)
N$13  (1 unrouted)
N$14  (1 unrouted)
N$15  (2 unrouted)
N$16  (1 unrouted)
N$18  (1 unrouted)
N$19  (2 unrouted)
N$20  (2 unrouted)
N$21  (1 unrouted)
PITCH  (2 unrouted)
POT1  (1 unrouted)
POT2  (1 unrouted)
POT3  (1 unrouted)
POT4  (1 unrouted)
PROG_SEL  (2 unrouted)
RESET  (5 unrouted)
RFN  (1 unrouted)
RFP  (1 unrouted)
ROLL  (2 unrouted)
RXI  (1 unrouted)
RXI-0  (1 unrouted)
RXI-1  (1 unrouted)
RXLED  (1 unrouted)
SCK  (1 unrouted)
THROTTLE  (2 unrouted)
TXLED  (1 unrouted)
TXO  (1 unrouted)
TXO-0  (1 unrouted)
TXO-1  (1 unrouted)
USB_D+  (1 unrouted)
USB_D-  (1 unrouted)
VBAT  (9 unrouted)
VBUS  (3 unrouted)
  pour Top: 19.25,36.12 14.25,36.12 14.25,41.88 19.25,41.88
  pour Bottom: 19.25,36.12 14.25,36.12 14.25,41.88 19.25,41.88
YAW  (2 unrouted)
(copper drawn outside any net)
  shapes: Bottom area x1

### Text on the board
Top: The non-serial LCD displays are $14 / and take 11 pins. 3 PWM. / There's an RGB version. / https://www.sparkfun.com/products/10862 / We just need the top holes for mounting. THe bottom edge can be supported by the header. | 18-pin header | Top Metal
Route2: Upper Inner Metal
Route15: Lower Inner Metal
Bottom: Bottom Metal
tPlace: off | on | RC | Quadremote / Mark IV | Quad | Ignore four drills outside of board area | DTR | Ignore four drills outside of board area | TX | RX | GND | 3.3V | reset | charging | complete | Steven / Swanson
tDocu: cutout | adjustment / hole